# Altium schematic sheet Sheet1.SchDoc
size A4
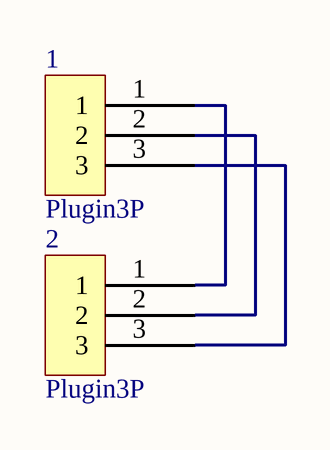
[diagram p0: Sheet1.SchDoc]

## Parts
1  Plugin3P  [Plugin3P]
2  Plugin3P  [Plugin3P]

## Nets
Net1_1: 1.1 2.1
Net1_2: 1.2 2.2
Net1_3: 1.3 2.3